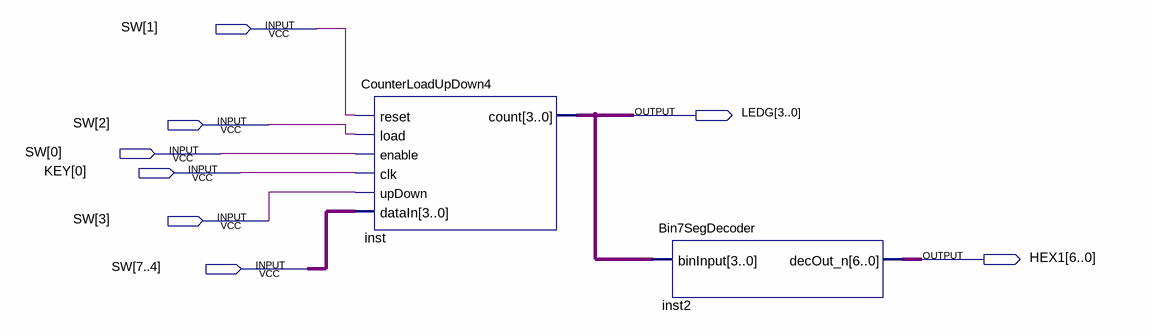
[diagram p0: schematic sheet]
// Quartus schematic Counter_Demo.bdf as structural Verilog: 2 symbols, 8 pins
module Counter_Demo (
  input  [7:0] SW,
  input  [0:0] KEY,
  output [3:0] LEDG,
  output [6:0] HEX1
);

  CounterLoadUpDown4 inst (
    .reset(SW[1]), .load(SW[2]), .enable(SW[0]), .clk(KEY[0]), .upDown(SW[3]), .dataIn(SW[7:4]), .count(LEDG));
  Bin7SegDecoder inst2 (.binInput(LEDG), .decOut_n(HEX1));
endmodule
